# Altium schematic sheet IO.SchDoc
size A4
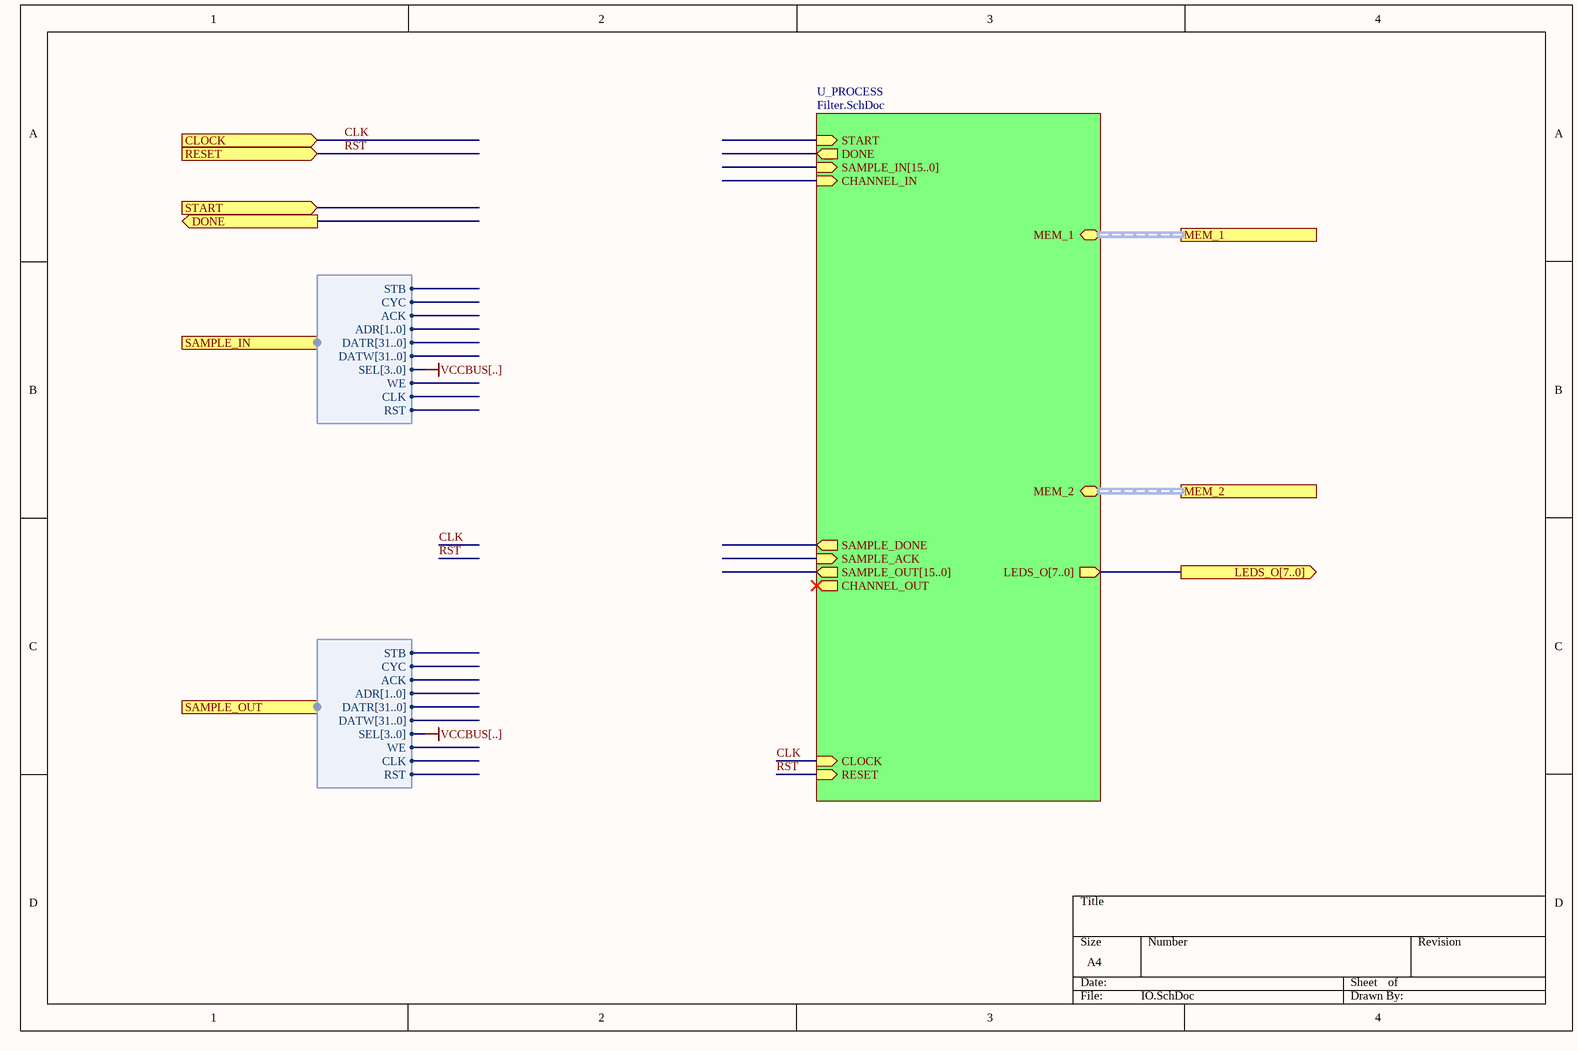
[diagram p0: IO.SchDoc]

## Sub-sheets
U_PROCESS = Filter.SchDoc: MEM_1 (harness WB_19_32_8), SAMPLE_IN[15..0] (in), SAMPLE_OUT[15..0] (out), START (in), DONE (out), MEM_2 (harness WB_19_32_8), LEDS_O[7..0] (out), CHANNEL_IN (in), CLOCK (in), RESET (in), CHANNEL_OUT (out), SAMPLE_DONE (out), SAMPLE_ACK (in)

## Ports
CLOCK (in), DONE (out), LEDS_O[7..0] (out), MEM_1 (harness WB_19_32_8), MEM_2 (harness WB_19_32_8), RESET (in), SAMPLE_IN (harness WB_2_32_8), SAMPLE_OUT (harness WB_2_32_8), START (in)

## Harnesses
WB_2_32_8: STB, CYC, ACK, ADR[1..0], DATR[31..0], DATW[31..0], SEL[3..0], WE, CLK, RST

## Nets
CLK: port CLOCK, sheet U_PROCESS/CLOCK
RST: port RESET, sheet U_PROCESS/RESET

## Buses and harness runs
bus port LEDS_O[7..0] = sheet U_PROCESS/LEDS_O[7..0]
harness port MEM_1 = sheet U_PROCESS/MEM_1
harness port MEM_2 = sheet U_PROCESS/MEM_2

## Notes on the sheet
- Labels drawn without touching a wire or pin: VCCBUS[..]